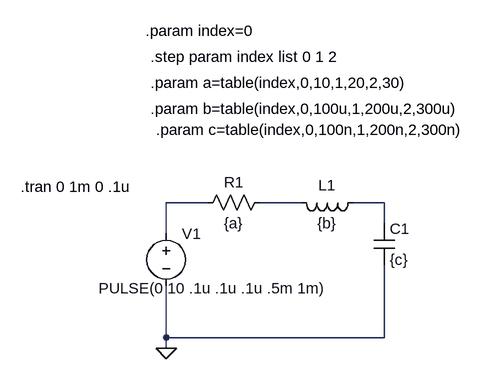
[diagram p0: schematic tripleparametro.asc]
tripleparametro.asc, the LTspice schematic file:
Version 4
SHEET 1 884 680
WIRE 112 176 48 176
WIRE 256 176 192 176
WIRE 384 176 336 176
WIRE 384 208 384 176
WIRE 48 224 48 176
WIRE 48 384 48 304
WIRE 384 384 384 272
WIRE 384 384 48 384
WIRE 48 400 48 384
FLAG 48 400 0
SYMBOL res 208 160 R90
WINDOW 0 0 56 VBottom 2
WINDOW 3 32 56 VTop 2
SYMATTR InstName R1
SYMATTR Value {a}
SYMBOL cap 368 208 R0
SYMATTR InstName C1
SYMATTR Value {c}
SYMBOL voltage 48 208 R0
WINDOW 3 -104 100 Left 2
WINDOW 123 0 0 Left 0
WINDOW 39 0 0 Left 0
SYMATTR Value PULSE(0 10 .1u .1u .1u .5m 1m)
SYMATTR InstName V1
SYMBOL ind 352 160 R90
WINDOW 0 5 56 VBottom 2
WINDOW 3 32 56 VTop 2
SYMATTR InstName L1
SYMATTR Value {b}
TEXT -176 152 Left 2 !.tran 0 1m 0 .1u
TEXT 16 -88 Left 2 !.param index=0
TEXT 24 -48 Left 2 !.step param index list 0 1 2
TEXT 24 -8 Left 2 !.param a=table(index,0,10,1,20,2,30)
TEXT 24 32 Left 2 !.param b=table(index,0,100u,1,200u,2,300u)
TEXT 32 64 Left 2 !.param c=table(index,0,100n,1,200n,2,300n)

The netlist it stands for:
* tripleparametro.asc
R1 N002 N001 {a}
C1 N003 0 {c}
V1 N001 0 PULSE(0 10 .1u .1u .1u .5m 1m)
L1 N003 N002 {b}
.tran 0 1m 0 .1u
.param index=0
.step param index list 0 1 2
.param a=table(index,0,10,1,20,2,30)
.param b=table(index,0,100u,1,200u,2,300u)
.param c=table(index,0,100n,1,200n,2,300n)
.backanno
.end